# EAGLE board main_xml (EAGLE 7.7.0)
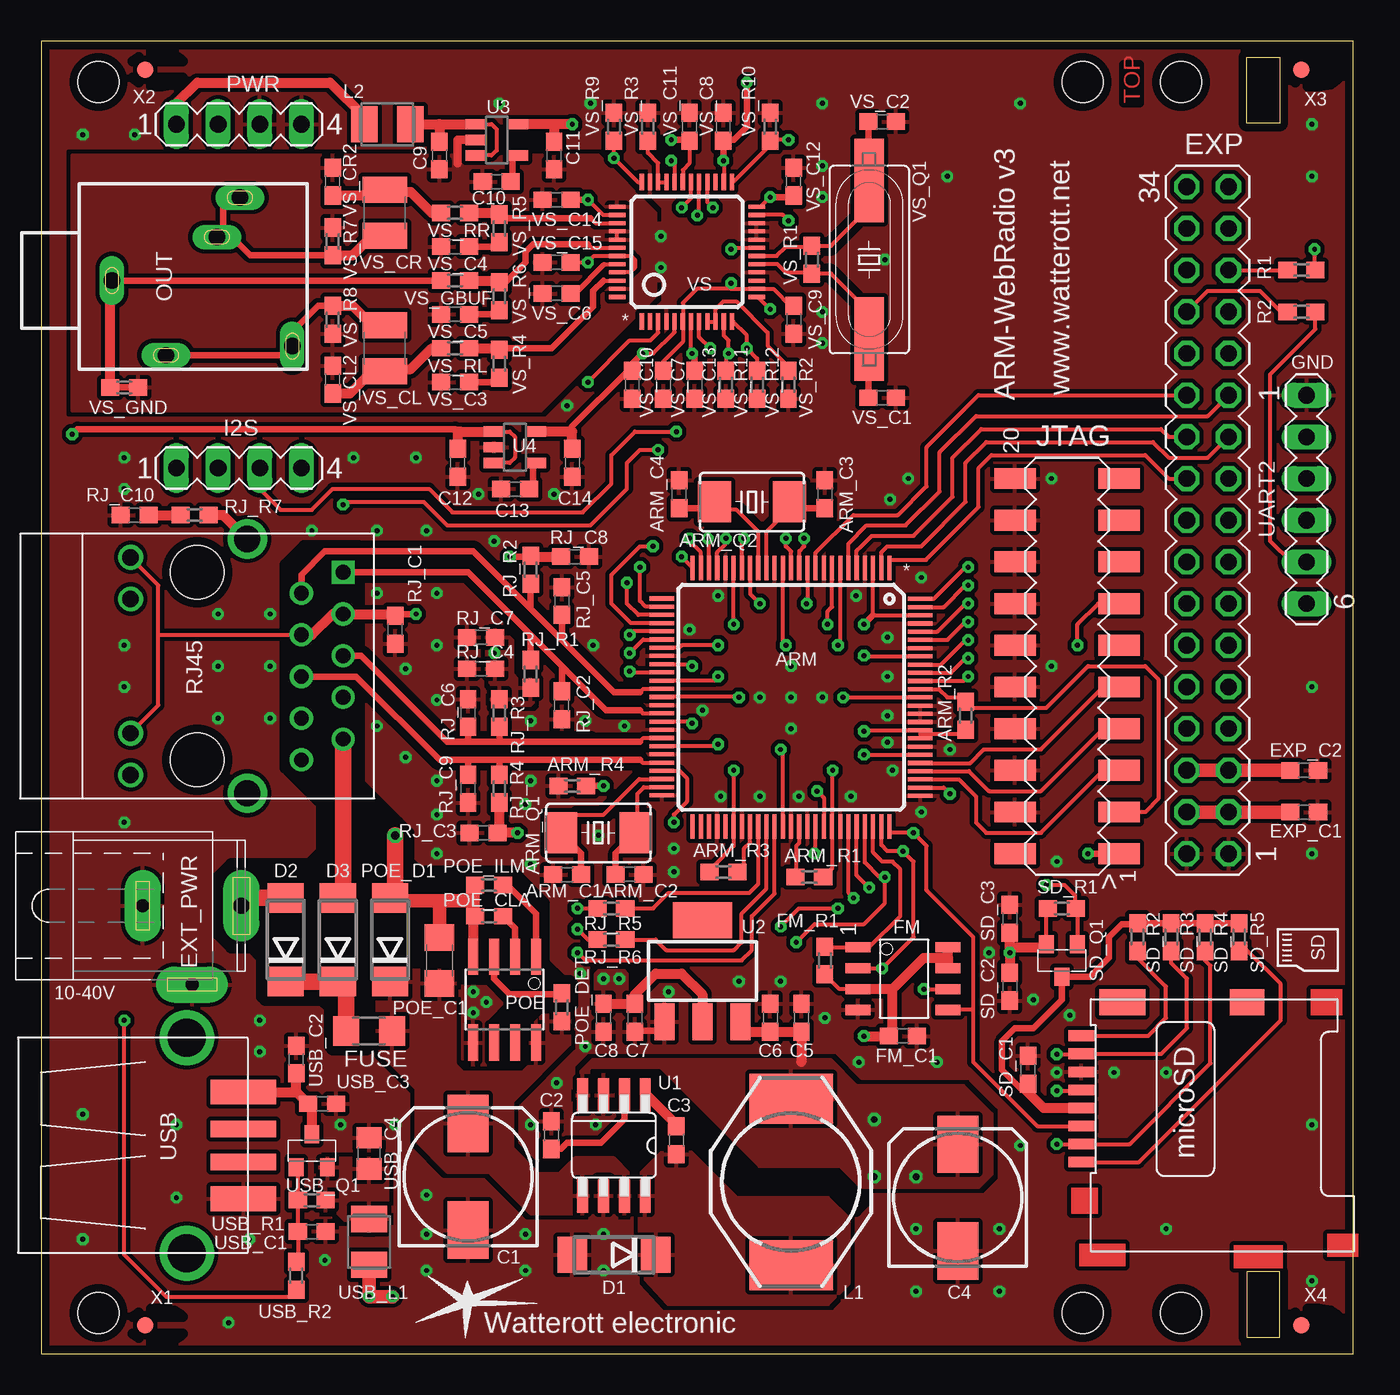
[diagram p4: board, top side]
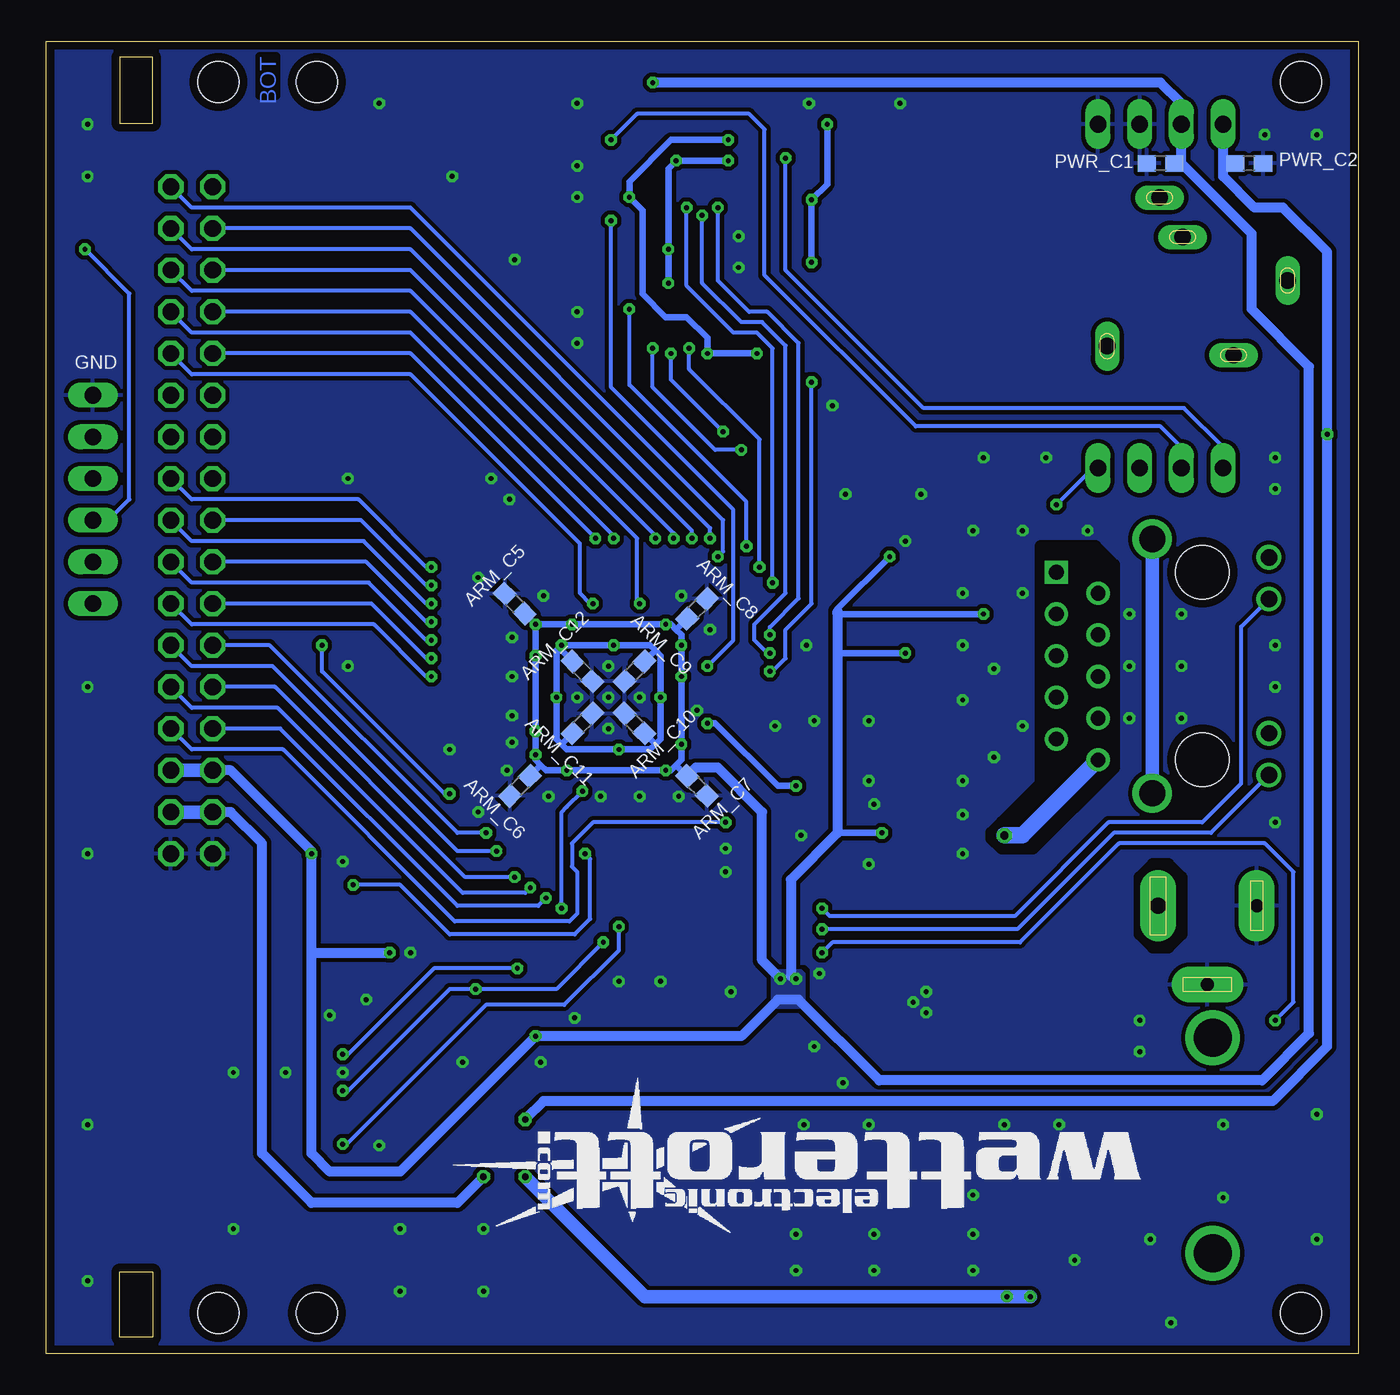
[diagram p5: board, bottom side, seen from below]

Size 80 x 80 mm. Coordinates in mm from the lower left corner, seen from the top.
Outline: 0,0 80,0 80,80 0,80 0,0
Outline: 75.5,1 75.5,5 73.5,5 73.5,1 75.5,1
Outline: 75.5,79 75.5,75 73.5,75 73.5,79 75.5,79
Copper layers (1*16): Top 0.035mm / dielectric 1.5mm / Bottom 0.035mm
Design rules "default *": minimum track width 7mil, minimum drill 0.3mm, track to track 7mil, track to pad 7mil, pad to pad 7mil, via to via 7mil, smd to smd 7mil, copper to edge 20mil, drill to drill 8mil, minimum pad ring 10mil, minimum via ring 8mil, stop-mask expansion 4mil, vias tented up to drill 0.5mm, thermal gap 10mil
Holes 2.5 mm at 3.5,77.5 69.5,77.5 3.5,2.5 69.5,2.5 63.5,2.5 63.5,77.5
tRestrict: area 10.8,18.6 to 32.4,49.2; area 49.7,8.7 to 50.3,9.4; 31 lines
bRestrict: area 14.9,30.8 to 22.4,49.2; area 10.8,24.8 to 13.3,29.8

## Footprints (pad centres in the part's own frame; a part is rotated, then mirrored left to right if it is on the bottom)
LQFP100 = smd 1.5 x 0.25: 1 -7.875,6; 2 -7.875,5.5; 3 -7.875,5; 4 -7.875,4.5; 5 -7.875,4; 6 -7.875,3.5; 7 -7.875,3; 8 -7.875,2.5; 9 -7.875,2; 10 -7.875,1.5; 11 -7.875,1; 12 -7.875,0.5; 13 -7.875,0; 14 -7.875,-0.5; 15 -7.875,-1; 16 -7.875,-1.5; 17 -7.875,-2; 18 -7.875,-2.5; 19 -7.875,-3; 20 -7.875,-3.5; 21 -7.875,-4; 22 -7.875,-4.5; 23 -7.875,-5; 24 -7.875,-5.5; 25 -7.875,-6; 51 7.875,-6; 52 7.875,-5.5; 53 7.875,-5; 54 7.875,-4.5; 55 7.875,-4; 56 7.875,-3.5; 57 7.875,-3; 58 7.875,-2.5; 59 7.875,-2; 60 7.875,-1.5; 61 7.875,-1; 62 7.875,-0.5; 63 7.875,0; 64 7.875,0.5; 65 7.875,1; 66 7.875,1.5; 67 7.875,2; 68 7.875,2.5; 69 7.875,3; 70 7.875,3.5; 71 7.875,4; 72 7.875,4.5; 73 7.875,5; 74 7.875,5.5; 75 7.875,6 | smd 0.25 x 1.5: 26 -6.025,-7.875; 27 -5.525,-7.875; 28 -5.025,-7.875; 29 -4.525,-7.875; 30 -4.025,-7.875; 31 -3.525,-7.875; 32 -3.025,-7.875; 33 -2.525,-7.875; 34 -2.025,-7.875; 35 -1.525,-7.875; 36 -1.025,-7.875; 37 -0.525,-7.875; 38 -0.025,-7.875; 39 0.475,-7.875; 40 0.975,-7.875; 41 1.475,-7.875; 42 1.975,-7.875; 43 2.475,-7.875; 44 2.975,-7.875; 45 3.475,-7.875; 46 3.975,-7.875; 47 4.475,-7.875; 48 4.975,-7.875; 49 5.475,-7.875; 50 5.975,-7.875; 76 6,7.875; 77 5.5,7.875; 78 5,7.875; 79 4.5,7.875; 80 4,7.875; 81 3.5,7.875; 82 3,7.875; 83 2.5,7.875; 84 2,7.875; 85 1.5,7.875; 86 1,7.875; 87 0.5,7.875; 88 0,7.875; 89 -0.5,7.875; 90 -1,7.875; 91 -1.5,7.875; 92 -2,7.875; 93 -2.5,7.875; 94 -3,7.875; 95 -3.5,7.875; 96 -4,7.875; 97 -4.5,7.875; 98 -5,7.875; 99 -5.5,7.875; 100 -6,7.875
C0603 = smd 1.1 x 1: 1 -0.85,0; 2 0.85,0
CS10 = smd 2 x 2.5: 1 -2.286,0; 2 2.286,0
R0603 = smd 1.1 x 1: 1 -0.85,0; 2 0.85,0
153CLV-0810 = smd 3.5 x 2.5: + 3.25,0; - -3.25,0
DO214AA = smd 1.8 x 2.2: A 2.55,0; C -2.55,0
MA17-2 = drill 1.016 octagon: 1 -20.32,-1.27; 2 -20.32,1.27; 3 -17.78,-1.27; 4 -17.78,1.27; 5 -15.24,-1.27; 6 -15.24,1.27; 7 -12.7,-1.27; 8 -12.7,1.27; 9 -10.16,-1.27; 10 -10.16,1.27; 11 -7.62,-1.27; 12 -7.62,1.27; 13 -5.08,-1.27; 14 -5.08,1.27; 15 -2.54,-1.27; 16 -2.54,1.27; 17 0,-1.27; 18 0,1.27; 19 2.54,-1.27; 20 2.54,1.27; 21 5.08,-1.27; 22 5.08,1.27; 23 7.62,-1.27; 24 7.62,1.27; 25 10.16,-1.27; 26 10.16,1.27; 27 12.7,-1.27; 28 12.7,1.27; 29 15.24,-1.27; 30 15.24,1.27; 31 17.78,-1.27; 32 17.78,1.27; 33 20.32,-1.27; 34 20.32,1.27
SPC4077 = drill 0.8 pad 2.184 long: 1 -3,0; 2 0,-4.8 | drill 1 pad 2.184 long: 3 3,0
SO8 = smd 0.61 x 1.524: 1 -1.27,-2.743; 2 0,-2.743; 3 1.27,-2.743; 4 2.54,-2.743; 5 2.54,2.743; 6 1.27,2.743; 7 0,2.743; 8 -1.27,2.743
R1206 = smd 1.6 x 1.8: 1 -1.4,0; 2 1.4,0
MA04-1 = drill 1.016 long: 1 -3.81,0; 2 -1.27,0; 3 1.27,0; 4 3.81,0
MA10-2_SMD = smd 1.27 x 2.54: 1 -11.43,-3.175; 2 -11.43,3.175; 3 -8.89,-3.175; 4 -8.89,3.175; 5 -6.35,-3.175; 6 -6.35,3.175; 7 -3.81,-3.175; 8 -3.81,3.175; 9 -1.27,-3.175; 10 -1.27,3.175; 11 1.27,-3.175; 12 1.27,3.175; 13 3.81,-3.175; 14 3.81,3.175; 15 6.35,-3.175; 16 6.35,3.175; 17 8.89,-3.175; 18 8.89,3.175; 19 11.43,-3.175; 20 11.43,3.175
CDRH = smd 3.048 x 5.08: 1 -5.08,0; 2 5.08,0
L3230M = smd 1.6 x 2.2: 1 -1.4,0; 2 1.4,0
1503_09 = drill 1 pad 1.2 long: 1 0,-2.1; 2 -4.55,-5.4; 3 5.05,-9.9; 4 -4,-13.1; 5 2.65,-8.5
SO08 = smd 0.61 x 2.21: 1 -1.905,-2.616; 2 -0.635,-2.616; 3 0.635,-2.616; 4 1.905,-2.616; 5 1.905,2.616; 6 0.635,2.616; 7 -0.635,2.616; 8 -1.905,2.616
C1206 = smd 1.6 x 1.8: 1 -1.4,0; 2 1.4,0
WE_POE = drill 0.9 square: 1 -5.715,8.89 | drill 0.9: 2 -4.445,6.35; 3 -3.175,8.89; 4 -1.905,6.35; 5 -0.635,8.89; 6 0.635,6.35; 7 1.905,8.89; 8 3.175,6.35; 9 4.445,8.89; 10 5.715,6.35 | drill 1: LED1+ -6.629,-4.064; LED1- -4.089,-4.064; LED2+ 4.089,-4.064; LED2- 6.629,-4.064 | drill 1.6: NC0 -7.747,3.048; NC1 7.747,3.048 | hole 3.25: -5.715,0; 5.715,0
MICRO-SD = smd 0.65 x 1.6: 1 -10.54,16.6; 2 -9.44,16.6; 3 -8.34,16.6; 4 -7.24,16.6; 5 -6.14,16.6; 6 -5.04,16.6; 7 -3.94,16.6; 8 -2.84,16.6 | smd 1.6 x 2.1: K1 -0.8,6.5 | smd 1.6 x 2.8: K2 -0.8,14.1
MICRO3 = smd 0.9 x 1.1: 1 -0.95,-1; 2 0.95,-1; 3 0,1
SO8' = smd 0.66 x 2.032: 1 -1.905,-3.073; 2 -0.635,-3.073; 3 0.635,-3.073; 4 1.905,-3.073; 5 1.905,3.073; 6 0.635,3.073; 7 -0.635,3.073; 8 -1.905,3.073
SOT223 = smd 1.219 x 2.235: 1 -2.311,-3.099; 2 0,-3.099; 3 2.311,-3.099 | smd 3.6 x 2.2: 4 0,3.099
SOT23-5 = smd 0.635 x 1.27: 1 -0.953,-1.27; 2 0,-1.27; 3 0.953,-1.27; 4 0.953,1.27; 5 -0.953,1.27
MA06-1 = drill 1.016 long: 1 -6.35,0; 2 -3.81,0; 3 -1.27,0; 4 1.27,0; 5 3.81,0; 6 6.35,0
USB-A-S = smd 4 x 1: D+ 3.45,-1; D- 3.45,1 | smd 4 x 1.5: GND 3.45,-3.25; VBUS 3.45,3.25 | drill 2.311: P$5 0,-6.566; P$6 0,6.566
C0805 = smd 1.3 x 1.5: 1 -0.95,0; 2 0.95,0
LQFP-48 = smd 0.25 x 1: 1 -2.75,-4.25; 2 -2.25,-4.25; 3 -1.75,-4.25; 4 -1.25,-4.25; 5 -0.75,-4.25; 6 -0.25,-4.25; 7 0.25,-4.25; 8 0.75,-4.25; 9 1.25,-4.25; 10 1.75,-4.25; 11 2.25,-4.25; 12 2.75,-4.25; 25 2.75,4.25; 26 2.25,4.25; 27 1.75,4.25; 28 1.25,4.25; 29 0.75,4.25; 30 0.25,4.25; 31 -0.25,4.25; 32 -0.75,4.25; 33 -1.25,4.25; 34 -1.75,4.25; 35 -2.25,4.25; 36 -2.75,4.25 | smd 1 x 0.25: 13 4.25,-2.75; 14 4.25,-2.25; 15 4.25,-1.75; 16 4.25,-1.25; 17 4.25,-0.75; 18 4.25,-0.25; 19 4.25,0.25; 20 4.25,0.75; 21 4.25,1.25; 22 4.25,1.75; 23 4.25,2.25; 24 4.25,2.75; 37 -4.25,2.75; 38 -4.25,2.25; 39 -4.25,1.75; 40 -4.25,1.25; 41 -4.25,0.75; 42 -4.25,0.25; 43 -4.25,-0.25; 44 -4.25,-0.75; 45 -4.25,-1.25; 46 -4.25,-1.75; 47 -4.25,-2.25; 48 -4.25,-2.75
C1210 = smd 1.6 x 2.7: 1 -1.4,0; 2 1.4,0
SM49 = smd 5.08 x 1.778: 1 -4.826,0; 2 4.826,0
SMD-ELLIPSE = smd 1 x 1: 1 0,0

## Placement (x,y rotation side)
ARM  LM3S6950  [LQFP100]  45.72,40.01 270 top
ARM_C1  18pF  [C0603]  32.07,29.21 180 top
ARM_C2  18pF  [C0603]  35.88,29.21 0 top
ARM_C3  18pF  [C0603]  47.78,52.39 90 top
ARM_C4  18pF  [C0603]  38.89,52.39 90 top
ARM_C5  100nF  [C0603]  51.44,45.72 135 bottom
ARM_C6  100nF  [C0603]  51.12,34.61 225 bottom
ARM_C7  100nF  [C0603]  40.32,34.61 315 bottom
ARM_C8  100nF  [C0603]  40.32,45.4 45 bottom
ARM_C9  100nF  [C0603]  44.13,41.59 225 bottom
ARM_C10  100nF  [C0603]  44.13,38.42 135 bottom
ARM_C11  100nF  [C0603]  47.31,38.42 45 bottom
ARM_C12  100nF  [C0603]  47.31,41.59 315 bottom
ARM_Q1  8MHz  [CS10]  33.97,31.75 180 top
ARM_Q2  25MHz  [CS10]  43.34,51.91 0 top
ARM_R1  10k  [R0603]  46.83,29.05 180 top
ARM_R2  10k  [R0603]  56.36,38.89 270 top
ARM_R3  10k  [R0603]  41.59,29.37 180 top
ARM_R4  12.4k  [R0603]  32.38,34.61 180 top
C1  22uF  [153CLV-0810]  26.04,10.79 90 top
C2  100nF  [C0603]  31.11,13.34 90 top
C3  100nF  [C0603]  38.73,13.02 270 top
C4  100uF  [153CLV-0810]  55.88,9.53 90 top
C5  2uF  [C0603]  46.36,20.48 90 top
C6  100nF  [C0603]  44.45,20.48 270 top
C7  100nF  [C0603]  36.2,20.48 270 top
C8  2uF  [C0603]  34.29,20.48 270 top
C9  2uF  [C0603]  24.29,73.03 90 top
C10  10nF  [C0603]  27.78,71.44 180 top
C11  2uF  [C0603]  31.27,73.03 270 top
C12  2uF  [C0603]  25.4,54.29 90 top
C13  10nF  [C0603]  28.89,52.7 180 top
C14  2uF  [C0603]  32.38,54.29 270 top
D1  [DO214AA]  34.92,6.03 180 top
D2  [DO214AA]  14.92,25.24 90 top
D3  [DO214AA]  18.1,25.24 90 top
EXP  [MA17-2]  71.12,50.8 90 top
EXP_C1  100nF  [C0603]  76.99,33.02 180 top
EXP_C2  100nF  [C0603]  76.99,35.56 180 top
EXT_PWR  [SPC4077]  9.21,27.3 0 top
FM  FM25V...  [SO8]  52.55,23.5 270 top
FM_C1  100nF  [C0603]  52.55,19.37 0 top
FM_R1  47k  [R0603]  47.78,23.97 270 top
FUSE  1A  [R1206]  20,19.68 0 top
I2S  [MA04-1]  12.06,53.98 0 top
JTAG  [MA10-2_SMD]  62.55,41.91 90 top
L1  100uH  [CDRH]  45.72,10.48 90 top
L2  10uH  [L3230M]  21.11,74.93 0 top
OUT  1503_09  [1503_09]  2.22,65.41 90 top
POE  TPS2375D  [SO08]  28.26,21.59 180 top
POE_C1  100nF  [C1206]  24.29,23.97 90 top
POE_CLA  4,3k  [R0603]  27.3,26.67 0 top
POE_D1  SMAJ58A  [DO214AA]  21.27,25.24 90 top
POE_DET  24k  [R0603]  31.75,21.11 90 top
POE_ILM  100k  [R0603]  27.3,28.57 0 top
PWR  [MA04-1]  12.06,74.93 0 top
PWR_C1  100nF  [C0603]  12.06,72.55 0 bottom
PWR_C2  100nF  [C0603]  6.67,72.55 180 bottom
R1  470*  [R0603]  76.84,66.04 0 top
R2  470*  [R0603]  76.83,63.5 0 top
RJ  RJ45-8-POEWE  [WE_POE]  9.53,41.91 270 top
RJ_C1  100nF  [C0603]  21.59,44.13 270 top
RJ_C2  10pF  [C0603]  31.75,39.53 90 top
RJ_C3  10nF  [C0603]  26.99,31.75 0 top
RJ_C4  10nF  [C0603]  26.83,41.75 0 top
RJ_C5  10pF  [C0603]  31.75,45.88 270 top
RJ_C6  10pF  [C0603]  26.03,39.05 270 top
RJ_C7  10nF  [C0603]  26.83,43.66 0 top
RJ_C8  10nF  [C0603]  32.54,48.58 180 top
RJ_C9  10pF  [C0603]  26.04,34.45 90 top
RJ_C10  10nF  [C0603]  5.71,51.12 180 top
RJ_R1  50  [R0603]  29.84,41.43 270 top
RJ_R2  50  [R0603]  29.85,47.78 90 top
RJ_R3  50  [R0603]  27.94,39.05 90 top
RJ_R4  50  [R0603]  27.94,34.45 270 top
RJ_R5  470  [R0603]  34.77,27.15 0 top
RJ_R6  470  [R0603]  34.77,25.24 0 top
RJ_R7  100  [R0603]  9.37,51.12 0 top
SD  MICRO-SD  [MICRO-SD]  80.01,22.23 90 top
SD_C1  100nF  [C0603]  60.17,17.3 90 top
SD_C2  100nF  [C0603]  59.05,22.38 90 top
SD_C3  2uF  [C0603]  59.05,26.51 270 top
SD_Q1  P-CHN  [MICRO3]  62.23,23.97 180 top
SD_R1  47k  [R0603]  62.23,27.15 0 top
SD_R2  47k  [R0603]  66.83,25.4 270 top
SD_R3  47k  [R0603]  68.9,25.4 270 top
SD_R4  47k  [R0603]  70.96,25.4 270 top
SD_R5  47k  [R0603]  73.03,25.4 270 top
U1  MAX5035BUSA  [SO8']  34.92,12.7 180 top
U2  TS1117-3V3  [SOT223]  40.32,23.34 0 top
U3  LP2985-2V8  [SOT23-5]  27.78,73.98 270 top
U4  LP2985-1V8  [SOT23-5]  28.89,55.24 270 top
UART2  [MA06-1]  77.15,52.07 270 top
USB  USB-A-S  [USB-A-S]  8.89,12.7 0 top
USB_C1  1uF  [C0603]  16.51,7.46 180 top
USB_C2  10nF  [C0603]  15.56,17.94 90 top
USB_C3  100nF  [C0603]  17.15,15.24 0 top
USB_C4  2uF  [C0805]  20,12.22 270 top
USB_L1  10uH  [L3230M]  20,6.83 90 top
USB_Q1  P-CHN  [MICRO3]  16.51,12.38 0 top
USB_R1  47k  [R0603]  16.51,9.37 180 top
USB_R2  24k  [R0603]  15.56,4.76 270 top
VS  VS1053  [LQFP-48]  39.37,67.15 0 top
VS_C1  27pF  [C0603]  51.28,58.26 0 top
VS_C2  27pF  [C0603]  51.28,75.09 0 top
VS_C3  10nF  [C0603]  25.24,59.21 0 top
VS_C4  10nF  [C0603]  25.24,67.47 0 top
VS_C5  47nF  [C0603]  25.24,63.34 0 top
VS_C6  1uF  [C0603]  31.43,64.61 0 top
VS_C7  100nF  [C0603]  37.94,59.06 270 top
VS_C8  100nF  [C0603]  41.59,74.77 90 top
VS_C9  100nF  [C0603]  45.88,63.02 270 top
VS_C10  100nF  [C0603]  36.04,59.05 270 top
VS_C11  100nF  [C0603]  39.53,74.77 90 top
VS_C12  100nF  [C0603]  45.88,71.44 90 top
VS_C13  100nF  [C0603]  39.85,59.06 270 top
VS_C14  100nF  [C0603]  31.43,70.33 180 top
VS_C15  100nF  [C0603]  31.43,66.52 180 top
VS_CL  10uF  [C1210]  20.95,61.28 90 top
VS_CL2  2.2nF  [C0603]  17.78,59.37 90 top
VS_CR  10uF  [C1210]  20.96,69.53 270 top
VS_CR2  2.2nF  [C0603]  17.78,71.44 90 top
VS_GBUF  0*  [R0603]  25.24,65.4 180 top
VS_GND  0*  [R0603]  5.08,58.9 0 top
VS_Q1  12.288MHz  [SM49]  50.48,66.67 270 top
VS_R1  1M  [R0603]  46.99,66.67 90 top
VS_R2  100k  [R0603]  45.56,59.05 90 top
VS_R3  100k  [R0603]  36.99,74.77 270 top
VS_R4  22  [R0603]  27.94,60.33 90 top
VS_R5  22  [R0603]  27.94,68.58 90 top
VS_R6  10  [R0603]  27.94,64.45 90 top
VS_R7  10k  [R0603]  17.78,67.79 90 top
VS_R8  10k  [R0603]  17.78,63.02 270 top
VS_R9  100k  [R0603]  34.93,74.77 90 top
VS_R10  100k  [R0603]  44.45,74.77 90 top
VS_R11  100k  [R0603]  41.75,59.06 270 top
VS_R12  100k  [R0603]  43.66,59.05 270 top
VS_RL  470  [R0603]  25.24,61.28 180 top
VS_RR  470  [R0603]  25.24,69.53 180 top
X1  [SMD-ELLIPSE]  6.35,1.75 90 top
X2  [SMD-ELLIPSE]  6.35,78.26 90 top
X3  [SMD-ELLIPSE]  76.84,78.26 90 top
X4  [SMD-ELLIPSE]  76.83,1.75 90 top

## Tracks (layer width: path | path; a pad name or v marks a point on that pad's centre or on a via)
5V_VIN
  Top 0.254: U3.3 27.46,73.03 27.78,73.34 27.78,74.61 27.46,74.93 U3.1
  Top 0.61: L2.2 24.29,74.93 | 24.29,74.93 C9.2 | 24.29,74.93 U3.1
7  (via drill 0.3)
  Top 0.254: ARM.47 38.92,35.53 39.37,35.08 39.37,33.66 38.58,32.86 v38.58,32.38
  Bottom 0.254: v38.58,32.38 46.67,32.38 47.94,31.11 47.94,29.69 47.62,29.37 47.62,26.83 48.1,26.35 55.09,26.35 65.56,36.83 71.12,36.83 EXP.7
8  (via drill 0.3)
  Top 0.254: ARM.70 49.22,28.09 v49.53,27.78
  Bottom 0.254: v49.53,27.78 50.01,27.3 54.93,27.3 65.72,38.1 EXP.8
9  (via drill 0.3)
  Top 0.254: ARM.71 49.72,29.18 v50.48,28.42
  Bottom 0.254: v50.48,28.42 50.8,28.1 54.61,28.1 65.88,39.37 71.12,39.37 EXP.9
13  (via drill 0.3)
  Top 0.254: ARM.90 56.24,41.01 v56.52,41.27
  Bottom 0.254: v56.52,41.27 | v56.52,41.27 56.83,41.27 60.01,44.45 71.12,44.45 EXP.13
14  (via drill 0.3)
  Top 0.254: ARM.91 55.48,41.51 56.36,42.39 v56.52,42.39
  Bottom 0.254: v56.52,42.39 56.83,42.39 60.17,45.72 EXP.14
15  (via drill 0.3)
  Top 0.254: ARM.92 54.86,42.01 56.36,43.5 v56.52,43.5
  Bottom 0.254: v56.52,43.5 56.83,43.5 60.33,46.99 71.12,46.99 EXP.15
16  (via drill 0.3)
  Top 0.254: ARM.95 55.25,43.51 56.36,44.61 v56.52,44.61
  Bottom 0.254: v56.52,44.61 56.83,44.61 60.48,48.26 EXP.16
17  (via drill 0.3)
  Top 0.254: ARM.96 54.64,44.01 56.36,45.72 v56.52,45.72
  Bottom 0.254: v56.52,45.72 56.83,45.72 60.64,49.53 71.12,49.53 EXP.17
18  (via drill 0.3)
  Top 0.254: ARM.99 55.03,45.51 56.36,46.83 v56.52,46.83 | v56.52,46.83
  Bottom 0.254: v56.52,46.83 56.83,46.83 60.8,50.8 EXP.18
19  (via drill 0.3)
  Top 0.254: ARM.100 54.42,46.01 56.36,47.94 v56.52,47.94 | v56.52,47.94
  Bottom 0.254: v56.52,47.94 56.83,47.94 60.96,52.07 71.12,52.07 EXP.19
20
  Top 0.254: 51.75,48.39 51.72,48.39 | 51.75,48.39 53.94,48.39 57.15,51.59 57.15,53.98 57.94,54.77 67.31,54.77 68.74,53.34 EXP.20 | ARM.1 51.72,48.35 51.75,48.39
21
  Top 0.254: ARM.2 51.22,48.84 51.59,49.21 53.66,49.21 56.36,51.91 56.36,54.29 57.63,55.56 67.79,55.56 68.74,54.61 71.12,54.61 EXP.21
22
  Top 0.254: ARM.5 49.72,48.93 50.01,49.21 50.64,49.85 53.18,49.85 55.56,52.23 55.56,54.61 57.31,56.36 68.26,56.36 68.74,55.88 EXP.22
23
  Top 0.254: ARM.6 49.22,49.38 50.32,50.48 52.7,50.48 54.77,52.55 54.77,54.93 56.99,57.15 71.12,57.15 EXP.23
24
  Top 0.254: ARM.10 47.22,48.81 49.53,51.12 52.23,51.12 53.98,52.86 53.98,55.24 57.15,58.42 EXP.24
25  (via drill 0.3)
  Top 0.254: ARM.11 46.72,45.77 v46.67,45.72
  Bottom 0.254: v46.67,45.72 46.83,45.72 47.47,46.35 47.47,49.37 57.78,59.69 71.12,59.69 EXP.25
26  (via drill 0.3)
  Top 0.254: v46.51,49.69 46.51,49.21 46.22,48.92 ARM.12
  Bottom 0.254: v46.51,49.69 | v46.51,49.69 57.78,60.96 EXP.26
27  (via drill 0.3)
  Top 0.254: v45.4,49.69 45.4,49.21 45.72,48.9 ARM.13
  Bottom 0.254: EXP.27 71.12,62.23 57.78,62.23 45.4,49.85 v45.4,49.69 | v45.4,49.69
28  (via drill 0.3)
  Top 0.254: v43.81,45.72 43.22,46.31 ARM.18 | R2.1 75.56,63.5 74.3,64.77 71.12,64.77 EXP.28
  Bottom 0.254: v43.81,45.72 43.97,45.88 43.97,49.69 57.78,63.5 EXP.28
29  (via drill 0.3)
  Top 0.254: v42.86,49.69 42.72,49.55 | v42.86,49.69 | ARM.19 42.72,49.55 | 42.72,49.55 v42.86,49.69 | EXP.29 R1.1 | R1.1
  Bottom 0.254: v42.86,49.69 42.86,49.85 57.78,64.77 71.12,64.77 EXP.29
30  (via drill 0.3)
  Top 0.254: v41.75,49.69 41.75,49.37 41.22,48.84 ARM.22
  Bottom 0.254: v41.75,49.69 41.75,50.01 57.78,66.04 EXP.30
31  (via drill 0.3)
  Top 0.254: v40.64,49.69 | v40.64,49.69 40.72,49.61 | ARM.23 40.72,49.61 | 40.72,49.61 v40.64,49.69
  Bottom 0.254: v40.64,49.69 40.64,50.16 57.78,67.31 71.12,67.31 EXP.31
32  (via drill 0.3)
  Top 0.254: v39.53,49.69 39.53,49.53 40.22,48.84 ARM.24
  Bottom 0.254: v39.53,49.69 39.53,50.32 57.78,68.58 EXP.32
33  (via drill 0.3)
  Top 0.254: ARM.25 39.72,47.91 v39.05,48.58
  Bottom 0.254: 38.73,48.9 38.73,50.8 57.78,69.85 71.12,69.85 EXP.33 | 38.73,48.9 | v39.05,48.58 38.73,48.9
+1V8  (via drill 0.3)
  Top 0.254: 45.72,70.48 | VS.7 39.62,61.03 v39.69,60.96 | VS.31 39.12,72.14 39.53,72.55 VS_C11.1 39.59,73.98 39.63,73.98 | VS.24 43.87,69.9 v44.45,70.48 | VS.5 38.62,62.27 38.58,62.23 37.31,60.96 v36.67,60.96 | 32.38,56.2 32.38,56.36 | 45.72,70.48 45.78,70.48 VS_C12.1 | 36.14,59.85 36.09,59.85 VS_C10.1 | VS_C13.1
  Top 0.406: v38.42,73.98 39.63,73.98 | v44.45,70.48 45.72,70.48 45.82,70.48 | 32.38,56.36 32.38,56.52 35.72,59.85 36.14,59.85 | VS_C10.1 36.04,60.33 v36.67,60.96 | VS_C13.1 39.85,60.8 v39.69,60.96
  Top 0.61: U4.5 32.38,56.2 C14.1
  Bottom 0.254: v39.69,60.96
  Bottom 0.406: v38.42,73.98 41.91,73.98 44.45,71.44 v44.45,70.48 43.66,69.69 43.66,64.61 42.23,63.18 40.96,63.18 39.69,61.91 v39.69,60.96 | v36.67,60.96 v39.69,60.96
+2V5  (via drill 0.3)
  Top 0.254: 42.55,40.03 v42.55,40.01 42.52,40.03 ARM.38 | ARM.62 45.22,36.7 v45.09,36.83 | v48.9,40.01 ARM.88 | ARM.7 48.72,43.32 v48.58,43.18 | ARM.14 45.22,43.36 v45.4,43.18
  Bottom 0.254: v48.58,43.18 48.74,43.02 | v48.58,43.18
  Bottom 0.406: 42.86,37.15 42.55,37.47 v42.55,40.01 42.55,42.55 42.86,42.86 | 42.86,37.15 43.18,36.83 v45.09,36.83 48.26,36.83 48.58,37.15 | 42.86,42.86 43.18,43.18 v45.4,43.18 v48.58,43.18 48.9,42.86 v48.9,40.01 48.9,37.47 48.58,37.15 | 42.86,42.86 ARM_C9.1 | 42.86,37.15 ARM_C10.1 | 48.58,37.15 ARM_C11.1 | 48.74,43.02 ARM_C12.1
+2V8  (via drill 0.3)
  Top 0.254: VS.38 34.26,69.4 v33.34,70.33 | VS_C15.1 v33.34,66.52 33.72,66.9 VS.43 35.97,66.9 36.2,66.67 36.2,66.2 35.9,65.9 VS.45
  Top 0.406: 32.23,70.33 VS_C14.1 v33.34,70.33 | 31.11,74.93 | v32.38,74.93
  Top 0.61: 31.27,74.93 31.11,74.93 U3.5 | 31.27,74.93 C11.1 | v32.38,74.93 31.27,74.93
  Bottom 0.406: v33.34,66.52 v33.34,70.33 32.38,71.28 v32.38,74.93
+3V3  (via drill 0.3)
  Top 0.254: v47.94,44.45 47.94,45.24 48.22,45.52 ARM.8 | FM.8 55.24,24.77 55.29,24.72 | v41.27,43.18 39.05,43.18 38.9,43.03 ARM.32 | 51.85,19.53 51.91,19.53 | 42.07,64.9 39.98,64.9 39.12,64.04 VS.6 39.12,61.66 37.94,60.48 VS_C7.1 | 42.07,64.9 VS.14 44.64,64.9 45.72,63.82 45.82,63.82 VS_C9.1 | v42.07,65.25 42.07,64.9 | VS.32 38.62,72.5 v38.42,72.71 | 41.43,72.71 v41.59,72.71 41.62,72.68 VS.26 | ARM.44 41.16,37.03 v41.27,37.15 | ARM.36 41.03,41.03 v41.27,41.27 | v48.26,35.56 48.22,35.52 ARM.68 48.22,29.59 ARM_R1.1 | v42.23,35.56 v42.22,35.55 ARM.56 42.22,30.95 40.96,29.69 40.96,29.58 ARM_R3.2 | ARM.98 50.72,45.01 ARM.3 | ARM.93 50.2,42.51 v50.16,42.55 | SD_R1.1 61.28,27.05 SD_Q1.2 61.28,24.77 | RJ.LED1+ 5.46,48.51 7.14,46.83 7.14,43.81 | RJ.LED2+ 5.46,37.85 7.14,39.53 7.14,43.81 | 7.14,43.81 RJ.4 | VS_C7.1 | VS_C9.1 | VS.19 42.16,67.4 v42.07,67.31 | ARM.20 v42.22,44.46 v42.23,44.45 | RJ_C3.2 27.94,31.85 | 50.01,22.23 48.68,22.23 FM_R1.2 | ARM.81 50.17,36.51 v50.16,36.51 | v50.16,37.94 50.23,38.01 ARM.84 53.59,37.78 | 53.59,37.78 ARM.83 | 56.09,37.78 53.59,37.78
  Top 0.406: 50.01,22.23 FM.3 | FM_C1.1 51.85,19.53 | v41.59,72.71 VS_C8.1 41.65,73.98 42.23,73.98 43.02,74.77 v43.02,77.47 | v50.16,44.45 50.72,45.01 | v63.82,30.48 JTAG.1 | v22.86,45.09 21.69,45.09 RJ_C1.1 | 56.09,37.78 ARM_R2.2 | 29.9,48.58 RJ_R2.2 29.79,48.58 v28.57,48.58
  Top 0.61: RJ.4 16.51,43.81 17.78,45.09 RJ.3 21.49,45.09 RJ_C1.1 | 55.29,24.13 FM.7 | 55.29,24.13 55.29,24.72 | 51.91,19.53 51.91,22.23 | 51.91,22.23 50.01,22.23 | 51.91,22.23 53.82,24.13 55.29,24.13 | v50.16,19.37 FM_C1.1 | SD_C2.2 v59.05,24.45 59.05,24.77 | 59.05,24.77 SD_C3.2 | 59.05,24.77 61.28,24.77 | v29.05,31.75 RJ_C3.2 | 27.94,31.85 RJ_R4.2 | U2.2 40.32,21.91 39.05,23.18 37.47,23.18 36.2,21.91 C7.1 C8.1 | C8.1 | 29.9,48.58 RJ_C8.2
  Top 0.813: EXP.6 EXP_C2.2 | EXP.6
  Bottom 0.254: v42.07,67.31
  Bottom 0.406: v50.16,44.45 v47.94,44.45 v42.23,44.45 41.91,44.45 41.59,44.13 | 49.85,35.88 49.53,35.56 v48.26,35.56 v42.23,35.56 41.91,35.56 41.59,35.88 | 49.85,35.88 50.16,36.2 v50.16,36.51 v50.16,37.94 v50.16,42.55 v50.16,44.45 | 41.59,44.13 41.27,43.81 v41.27,43.18 v41.27,41.27 v41.27,37.15 41.27,36.2 41.59,35.88 | ARM_C7.1 41.59,35.88 | 49.85,35.88 ARM_C6.1 | 41.59,44.13 ARM_C8.1 | v50.16,44.45 ARM_C5.1 | v38.42,72.71 v41.59,72.71 42.07,72.23 v42.07,67.31 v42.07,65.25 | v27.62,42.7 31.75,42.7 | 31.75,31.75 v29.05,31.75 | v28.57,48.58 | v28.57,48.58 31.75,45.4 31.75,45.24 | v28.57,48.58 | v28.57,48.58 | v22.86,45.09 31.75,45.09
  Bottom 0.61: 63.82,24.45 63.82,12.22 62.71,11.11 58.42,11.11 v50.16,19.37 37.62,19.37 35.4,21.59 34.13,21.59 29.21,16.67 5.87,16.67 3.02,19.53 3.02,60.17 | 63.82,24.45 v63.82,30.48 63.82,30.64 | 63.82,24.45 v59.05,24.45 | v43.02,77.47 12.06,77.47 10.79,76.2 PWR.2 10.79,72.55 | ARM_C7.1 40.41,35.72 39.05,35.72 36.35,33.02 36.35,23.97 35.4,23.02 | 63.82,30.64 | 63.82,30.64 68.74,35.56 | 3.02,60.17 6.51,63.66 6.51,68.26 10.79,72.55 | 68.74,35.56 | 68.74,35.56 EXP.6 | 3.02,60.17 | 31.75,45.24 31.75,45.09 31.75,42.7 31.75,31.75 34.61,28.89 34.61,23.02 | 10.79,72.55 PWR_C1.2 | 10.79,72.55
  Bottom 0.813: EXP.6 EXP.5
  other vias: 34.29,22.86 35.24,22.86
  pour Top (isolate 0.254): 27.15,44.13 27.15,41.12 27.46,40.8 27.46,39.53 29.84,39.53 30.16,39.85 30.16,41.12 29.05,41.12 28.73,41.43 28.73,43.5 28.1,44.13
  pour Bottom (isolate 0.254): 33.81,23.18 33.97,23.34 35.56,23.34 35.72,23.18 35.72,21.27 35.56,21.11 33.97,21.11 33.81,21.27
  pour Top (isolate 0.254): 33.81,23.18 33.97,23.34 35.56,23.34 35.72,23.18 35.72,21.27 35.56,21.11 33.97,21.11 33.81,21.27
+5V  (via drill 0.3, 0.4)
  Top 0.254: U4.1 28.57,56.2 28.89,55.88 28.89,54.61 28.57,54.29 U4.3
  Top 0.406: U1.4 33.02,15.56 | 25.4,56.2 25.56,56.2 25.4,56.2 | 25.4,56.2 25.24,56.36 2.22,56.36 v1.91,56.04
  Top 0.61: 25.4,56.2 C12.2 | 25.56,56.2 U4.1 | PWR.1 8.26,76.2 9.53,77.47 17.62,77.47 19.71,75.38 L2.1 | C6.2 42.63,19.63 U2.3 | C6.2 C5.1 46.35,17.78 | C6.2
  Top 0.813: USB_L1.1 v20,3.49 v21.43,3.49 | EXP.4 EXP_C1.2
  Bottom 0.406: PWR.1 8.26,73.18 | 8.26,72.55 PWR_C2.2 | v50.8,14.29
  Bottom 0.61: 1.91,67.15 4.6,69.85 6.35,69.85 8.26,71.75 8.26,72.55 PWR.1 | EXP.4 68.74,33.02 66.83,31.11 66.83,12.22 63.82,9.21 54.93,9.21 v53.34,10.79 | v53.34,10.79 | 1.91,67.15 v1.91,56.04 1.91,18.73 5.24,15.4 49.69,15.4 v50.8,14.29 | 1.91,67.15
  Bottom 0.813: v50.8,10.79 43.5,3.49 v21.43,3.49 v20,3.49 | v50.8,10.79 | EXP.4 EXP.3
  pour Top (isolate 0.406): 43.82,11.43 37.78,17.46 33.5,17.46 33.34,17.3 33.34,15.08 32.7,15.08 32.7,16.99 33.65,17.94 48.1,17.94 49.69,16.35 56.2,16.35 57.94,14.61 57.94,10.95 57.15,10.16 50.01,10.16 48.74,11.43
AGND
  Top 0.254: VS.40 35.12,68.39 VS.41
  Top 0.508: U3.2 25.4,73.98 25.4,72.55
  pour Top (isolate 0.254): 1.91,73.03 33.97,73.03 37.47,69.53 37.47,64.45 30.48,57.47 1.91,57.47
BST
  Top 0.406: 36.83,15.88 U1.1
  Top 0.61: C3.1 38.73,13.97 36.83,15.88
CLASS
  Top 0.406: POE.2 28.89,25.93 POE_CLA.2
DET
  Top 0.254: 31.69,21.91 POE_DET.2
  Top 0.406: POE.3 27.62,22.86 28.57,21.91 31.69,21.91
ERBIAS  (via drill 0.3)
  Top 0.254: ARM.41 39.58,38.53 v39.69,38.42
  Top 0.406: ARM_R4.1 v34.29,34.61
  Bottom 0.406: v39.69,38.42 39.21,38.42 35.4,34.61 v34.29,34.61
FM_CS
  Top 0.254: 49.85,24.77 FM.1 | ARM.73 50.72,30.56 51.28,30 51.91,30 52.39,29.53 52.39,26.67 50.48,24.77 49.85,24.77 | 49.85,24.77 47.84,24.77 FM_R1.1
GBUF
  Top 0.254: 27.84,65.41 VS_R6.2 | VS.42 33.56,67.4 33.34,67.63
  Top 0.406: 33.34,67.63 30,67.63 29.53,67.15 29.53,66.52 28.31,65.3 VS_R6.2
  Top 0.61: VS_GBUF.1 27.84,65.41
GND  (via drill 0.3)
  Top 0.406: 36.2,19.68 37.94,19.68
  other vias: 37.78,66.2 45.72,40.01 40.32,39.21 53.66,47.31 51.59,38.89 55.4,36.83 53.34,3.81 43.81,33.97 51.59,41.27 8.26,9.53 49.37,33.97 51.59,43.66 23.5,9.68 43.81,40.01 45.72,41.91 47.62,40.01 45.72,38.1 39.53,44.13 46.2,33.97 5.08,43.18 41.43,33.97 12.7,6.99 53.34,7.62 13.34,18.41 34.29,7.3 33.81,13.97 34.29,5.08 23.5,7.3 29.53,7.3 23.5,5.08 29.53,5.08 58.42,7.62 58.42,3.81 26.35,22.07 27.15,21.43 21.59,13.97 29.84,13.97 37.78,68.1 51.44,66.68 47.62,70.49 47.62,63.5 31.27,52.39 10.79,45.09 33.5,76.2 61.91,17.14 65.41,17.14 47.62,76.2 5.08,32.38 5.08,54.61 17.3,5.72 57.78,24.45 68.58,17.14 26.67,52.39 77.47,30.48 77.47,40.64 49.85,17.78 10.79,38.73 5.71,74.3 59.69,76.2 32.07,57.79 77.47,13.97 61.91,30 2.54,14.61 61.6,53.34 26.35,20.8 13.34,20.32 61.59,41.91 41.27,46.2 51.91,35.56 49.69,46.2 13.97,38.73 13.97,45.09 10.79,41.91 13.97,41.91 77.47,4.45 77.47,74.93 5.08,52.7 5.08,40.64 55.24,71.75 2.54,6.99 47.62,72.39 47.62,61.6 52.86,53.34 27.94,76.2 2.54,74.3 24.13,39.85 35.56,38.26 33.18,38.58 29.84,38.58 22.23,41.75 22.23,36.35 29.84,34.92 20.48,46.35 33.65,43.18 38.58,29.37 24.13,34.92 29.84,29.84 59.69,12.7 60.48,21.59 54.61,17.78 27.62,49.53 22.86,54.61 31.43,16.51 20.48,50.16 18.26,13.97 20.48,38.26 51.75,52.07 77.47,71.75 38.26,22.07 45.09,22.7 47.78,20.48 53.66,33.02 38.58,30.8 42.55,22.7 24.13,30.48 24.13,43.18 24.13,32.86 29.53,33.5 8.26,13.97 32.86,23.18 33.18,18.73 23.49,50.16 16.51,50.16 68.58,7.62 24.13,46.36 33.97,31.59 62.71,20.64 51.59,37.26 11.43,1.91 19.05,54.61
  pour Top (isolate 0.254, rank 2): 0.5,79.5 79.5,79.5 79.5,0.5 0.5,0.5
  pour Bottom (isolate 0.254, rank 2): 0.5,79.5 79.5,79.5 79.5,0.5 0.5,0.5
  pour Top (isolate 0.254): 37.15,68.9 38.42,68.9 38.42,65.41 37.15,65.41
I2S_LROUT  (via drill 0.3)
  Top 0.254: VS.36 36.39,71.4 v34.92,72.87 VS_R9.1 | VS_R9.1
  Bottom 0.254: 26.51,57.63 34.92,66.04 v34.92,72.87 | I2S.1 8.26,55.24 10.64,57.63 26.51,57.63 | 26.51,57.63
I2S_MCLK  (via drill 0.3)
  Top 0.254: VS.25 42.19,71.4 44.45,73.66 VS_R10.1 44.51,73.98 v45.56,73.98
  Bottom 0.254: 43.97,75.56 v45.56,73.98 | I2S.2 10.79,55.24 12.06,56.52 26.99,56.52 36.2,65.72 36.2,74.61 37.15,75.56 43.97,75.56 | 43.97,75.56
I2S_SCLK  (via drill 0.3)
  Top 0.254: VS.11 41.62,62.04 41.91,61.75 v41.91,60.96 41.75,60.8 VS_R11.1 | v38.73,56.2 36.2,56.2 34.77,54.77 34.77,53.02 33.02,51.28 25.08,51.28 23.65,52.7 17.78,52.7 16.51,51.44 14.61,51.44 13.34,52.7 I2S.3
  Bottom 0.254: v38.73,56.2 | v38.73,56.2 41.91,59.37 v41.91,60.96
I2S_SDATA  (via drill 0.3)
  Top 0.254: VS.12 42.19,62.9 43.02,62.07 v43.02,61.28 | v43.02,61.28 | VS_R12.1 43.66,60.64 v43.02,61.28 | v37.62,55.09 36.51,55.09 35.72,54.29 35.72,52.7 33.5,50.48 24.77,50.48 23.34,51.91 18.57,51.91 v18.41,51.75
  Bottom 0.254: 43.02,58.9 v43.02,61.28 | v43.02,61.28 | v37.62,55.09 39.21,55.09 43.02,58.9 | 43.02,58.9 | I2S.4 16.19,53.98 v18.41,51.75
ILM
  Top 0.254: 28.42,28.57 POE_ILM.2
  Top 0.406: POE.1 30.16,26.83 28.42,28.57
LED1
  Top 0.254: ARM.59 43.72,28.64 43.18,28.1 38.26,28.1 37.31,27.15 RJ_R5.2 | RJ_R5.2
LED2
  Top 0.254: ARM.60 44.22,28.34 42.7,26.83 42.7,25.08 42.23,24.61 38.1,24.61 37.47,25.24 RJ_R6.2
LEFT
  Top 0.254: 34.29,65.4 VS.46 | 27.84,61.28 VS_R4.2 27.94,61.28
  Top 0.406: 34.29,65.4 33.66,64.77 33.66,63.82 31.11,61.28 27.94,61.28
  Top 0.61: VS_RL.1 27.84,61.28
MDIO
  Top 0.254: ARM.58 43.22,31.16 42.86,30.8 42.86,29.79 ARM_R3.1
N$2
  pour Top (isolate 0.254): 16.99,11.91 21.11,11.91 21.11,7.46 19.21,7.46 17.94,8.73 16.99,8.73
N$3
  Top 0.254: VS.33 VS.34 37.62,72.55 36.99,73.18 VS_R3.2
N$4  (via drill 0.3)
  Top 0.254: RJ_R6.1 33.34,25.24 v32.7,25.88
  Bottom 0.254: RJ.LED2- 8.99,31.75 14.92,31.75 20.8,25.88 v32.7,25.88
N$5  (via drill 0.3)
  Top 0.254: v32.7,27.15 RJ_R5.1 | RJ_R5.1
  Bottom 0.254: RJ.LED1- 7.14,44.32 7.14,34.77 9.53,32.38 15.24,32.38 20.95,26.67 32.23,26.67 v32.7,27.15
N$6
  Top 0.254: VS.9 VS.10 41.12,63.66 41.59,64.14 42.39,64.14 44.29,62.23 44.29,61.44 45.72,60.01 45.72,59.91 VS_R2.2 | VS_R2.2
N$8
  Top 0.254: VS.18 44.84,66.9 45.4,67.47 46.93,67.47 VS_R1.2 48.16,67.53 50.48,69.85 VS_Q1.1
  Top 0.406: VS_Q1.1 | VS_C2.1 50.43,71.56 VS_Q1.1
N$9
  Top 0.254: ARM.48 36.46,35.03 34.29,32.86 32.54,32.86 31.75,32.07 31.75,31.81 ARM_Q1.2
  Top 0.406: ARM_C1.1 32.92,30.52 ARM_Q1.2
N$10
  Top 0.254: ARM.49 36.75,34.53 36.35,34.13 36.35,31.84 ARM_Q1.1
  Top 0.406: ARM_C2.1 35.03,30.52 ARM_Q1.1
N$11
  Top 0.254: VS.17 44.88,66.4 45.4,65.88 46.93,65.88 VS_R1.1 48.16,65.83 50.48,63.5 VS_Q1.2
  Top 0.406: VS_Q1.2 | VS_C1.1 50.43,61.79 VS_Q1.2
N$12
  Top 0.61: USB.VBUS 15.59,15.95 | 15.59,15.95 USB_C3.1 16.51,15.24 USB_Q1.3 | USB_C2.1 15.56,15.98 15.59,15.95
N$13
  Top 0.254: ARM.17 43.72,50.1 42.39,51.44 41.53,51.44 ARM_Q2.1
  Top 0.406: ARM_C4.1 40.68,51.54 ARM_Q2.1
N$14
  Top 0.254: 46,51.54 45.83,51.7 44.22,50.09 ARM.16
  Top 0.406: 46,51.54 ARM_C3.1 | 45.83,51.7 ARM_Q2.2
N$16
  Top 0.254: USB_Q1.1 15.66,11.28 USB_R1.2 USB_C1.2 | USB_C1.2 | USB_C1.2 15.66,5.71 USB_R2.1
N$18
  Top 0.406: 4.45,65.41 VS_GBUF.2 | 4.23,65.31 4.32,65.31 OUT.1 | 4.45,65.41 OUT.1 | 4.45,65.41 | 4.45,65.41 4.13,65.41 4.13,64.87 4.23,64.77
  Top 0.61: VS_GND.1 4.23,64.77 4.23,65.31
N$19
  Top 0.406: OUT.3 11.4,70.45 11.11,70.17 11.11,68.44 OUT.5 10.83,67.94 11.75,67.94 12.76,66.94 VS_R7.1
  Top 0.61: VS_R7.1 18.99,66.94 20,67.94 20.77,67.94 VS_CR.2
N$20
  Top 0.406: VS_R8.1 16.88,63.87 15.4,62.39 15.4,61.48 OUT.4 14.77,60.85 OUT.2
  Top 0.61: VS_R8.1 18.99,63.87 20.32,62.55 20.82,62.55 VS_CL.2
N$21
  Top 0.406: VS_CR.1 21.09,70.8
  Top 0.61: VS_CR2.1 20.61,70.59 VS_CR.1 | VS_RR.2 23.81,69.53 22.54,70.8 21.09,70.8
N$22
  Top 0.406: 20.82,60.01 VS_CL.1 21.09,60.01
  Top 0.61: VS_CL2.1 18.84,58.52 20.32,60.01 20.82,60.01 | VS_RL.2 23.81,61.28 22.54,60.01 21.09,60.01
N$23
  Top 1.016: D2.A 12.21,27.79 EXT_PWR.3
N$24
  Top 1.016: D2.C D3.C | D3.C | FUSE.1 18.6,22.19 D3.C
N$27
  Top 0.254: U3.4 | 28.73,73.03 U3.4 | U3.4 | 28.57,71.44 | C10.1 28.57,71.44 | 28.57,71.44 28.73,71.44
  Top 0.406: 28.73,71.44 28.73,73.03
N$28
  Top 0.406: C13.1 30,52.7 30,54.29 U4.4
N$29
  Top 0.406: RJ_C10.1
  Top 0.61: RJ_C10.1 RJ_R7.1
N$30
  Top 0.406: 4.29,58.9 5.87,58.9
N$31
  Top 0.254: 27.68,59.21 VS_R4.1
  Top 0.406: VS_C3.2 27.68,59.21
N$32
  Top 0.254: 27.68,67.47 VS_R5.1
  Top 0.406: VS_C4.2 27.68,67.47
N$33
  Top 0.254: 27.68,63.34 VS_R6.1
  Top 0.406: VS_C5.2 27.68,63.34
OUT
  pour Top (isolate 0.406): 36.51,4.92 36.51,10.95 38.1,12.54 39.37,12.54 42.39,9.53 47.94,9.53 49.21,8.26 49.21,4.29 47.94,3.02 38.26,3.02
POE+
  Top 0.254: D3.A 18.25,27.79 18.26,27.78
  Top 0.813: 18.26,27.78 18.41,27.94
  Top 1.016: 18.41,27.94 RJ.9
POE-  (via drill 0.5)
  Top 0.254: 21.59,27.79 POE_D1.A | 21.59,27.79
  Top 0.406: 26.35,26.57 POE_CLA.1 26.35,26.67 | 26.35,28.47 POE_ILM.1 | 21.59,27.79 22.21,27.79 22.38,27.62 | POE_C1.2 24.29,25.72
  Top 0.61: 26.35,26.57 POE.4
  Top 0.813: 26.35,27.62 26.35,26.67 | 26.35,27.62 26.35,28.47 | 24.29,27.62 22.38,27.62 | 24.29,27.62 26.35,27.62 | 24.29,25.72 24.29,27.62
  Top 1.016: 21.59,27.79 v21.59,31.59
  Bottom 0.813: RJ.10
  Bottom 1.016: v21.59,31.59 20.48,31.59 RJ.10
PWR+
  pour Top (isolate 0.406): 35.88,8.57 35.88,10.95 34.92,11.91 32.54,11.91 31.59,10.95 30.32,10.95 28.73,12.54 28.73,15.4 32.23,18.89 32.23,20.8 30.48,20.8 29.84,20.16 29.84,17.62 29.37,17.15 25.72,17.15 25.24,17.62 25.24,23.34 20.32,23.34 20.32,18.73 22.86,16.19 22.86,13.02 24.77,11.11 27.3,11.11 29.85,8.57 33.34,8.57 33.34,10.79 33.66,11.11 34.92,11.11 35.24,10.8 35.24,8.57
RCAP
  Top 0.254: 34.3,66.37 34.29,66.36 34.33,66.4 VS.44 | VS_C6.2 32.23,64.61 32.28,64.67
  Top 0.305: 34.3,66.37 32.6,64.67 32.28,64.67
RD+
  Top 0.254: ARM.40 36.69,39.03 36.51,39.21
  Top 0.406: 36.51,39.21 34.45,39.21 31.83,41.83 | RJ.1 26.04,47.62 29.84,43.81 | 29.84,43.81 31.83,41.83 | 29.84,43.81 RJ_R1.1 | RJ_C2.2 31.75,41.75 31.83,41.83
RD-
  Top 0.254: ARM.37 36.72,40.53 36.51,40.32
  Top 0.406: RJ.2 15.88,47.47 17.3,48.9 26.35,48.9 29.84,45.4 | 36.51,40.32 34.92,40.32 31.75,43.5 | 29.84,45.4 31.75,43.5 | 31.75,43.5 RJ_C5.2 | 29.84,45.4 RJ_R2.1 | 29.84,45.4
RESET
  Top 0.254: 46.22,29.03 46.2,29.05 ARM_R1.2 46.04,29.11 46.04,30.96 46.22,31.14 ARM.64
RIGHT
  Top 0.254: 27.84,69.53 VS_R5.2 28.16,69.22 | VS.39 33.81,68.9 33.5,69.22
  Top 0.406: 28.16,69.22 33.5,69.22
  Top 0.61: VS_RR.1 27.84,69.53
RXD
  Top 0.254: R2.2 77.69,62.45 74.93,59.69 74.93,49.53 76.2,48.26 UART2.5
SCK  (via drill 0.3)
  Top 0.254: v53.82,22.23 FM.6 | v61.91,16.03 63.36,16.03 SD.5 | v46.04,25.08 47.15,26.19 50.16,26.19 51.44,27.46 v51.44,29.05 | v51.44,29.05 | ARM.72 50.22,29.95 51.12,29.05 v51.44,29.05
  Bottom 0.254: v51.44,29.05 54.45,29.05 66.04,40.64 EXP.10 | v53.82,22.23 | v53.82,22.23 | v53.82,22.23 55.4,22.23 61.59,16.03 v61.91,16.03 | v53.82,22.23 48.9,22.23 v46.04,25.08
SD_1
  Top 0.254: SD_R5.2 73.08,24.61 73.5,24.61 75.56,22.54 75.56,20.32 66.93,11.69 SD.1
SD_3V3
  Top 0.254: 66.78,26.19 SD_R2.1
  Top 0.406: SD_R5.1 SD_R4.1 SD_R3.1 SD_R2.1 | 66.78,26.19 65.88,26.19 65.09,25.4 65.09,24.13 63.93,22.97 SD_Q1.3 62.23,21.59 60.48,19.84 59.37,19.84 58.58,19.05 58.58,17.3 59.69,16.19 59.91,16.19 SD_C1.1
  Top 0.61: SD.4 61.11,14.98 59.91,16.19
SD_8
  Top 0.254: SD.8 67.49,19.39 68.58,20.48 68.58,22.38 66.83,24.13 SD_R2.2 | SD_R2.2
SD_CS  (via drill 0.3)
  Top 0.254: SD_R4.2 70.96,23.97 71.28,23.65 71.28,17.71 66.36,12.79 SD.2 v61.91,12.79 | SD_R4.2 | ARM.67 47.72,33.88 v47.31,34.29 | v48.58,27.15 46.2,27.15 v45.09,26.04 | v45.09,26.04
  Bottom 0.254: v47.31,34.29 48.26,33.34 48.58,33.02 v48.58,27.15 | 61.67,12.79 v61.91,12.79 | 61.67,12.79 | 61.67,12.79 53.18,21.27 48.42,21.27 45.09,24.61 v45.09,26.04 | v45.09,26.04
SD_PWR  (via drill 0.3)
  Top 0.254: SD_Q1.1 63.18,27.05 SD_R1.2 63.02,27.2 63.02,27.94 62.39,28.57 v61.28,28.57 | ARM.66 47.22,30.55 v47.15,30.48
  Bottom 0.254: v47.15,30.48 46.83,30.16 46.83,26.51 47.78,25.56 55.4,25.56 58.42,28.57 v61.28,28.57
SHIELD
  Top 0.61: RJ.NC0 11.11,51.12 RJ_R7.2
  Bottom 0.813: RJ.NC1 RJ.NC0
SI  (via drill 0.3)
  Top 0.254: SD.3 60.73,13.88 56.83,17.78 56.83,20.95 | 51.72,32.1 ARM.75 51.72,31.78 51.75,31.75 v53.18,31.75 | 56.83,20.95 FM.5 | v53.18,31.75 | v53.18,31.75 | v53.18,31.75 53.98,30.96 53.98,28.26 56.83,25.4 56.83,20.95
  Bottom 0.254: v53.18,31.75 54.93,31.75 66.36,43.18 EXP.12
SO  (via drill 0.3)
  Top 0.254: v51.28,23.5 | v51.28,23.5 53.18,25.4 53.18,30 v52.55,30.64 | FM.2 v51.28,23.5 | v61.91,18.26 63.38,18.26 SD.7 68.29,18.29 69.85,19.84 69.85,22.86 68.9,23.81 SD_R3.2 | SD_R3.2 | ARM.74 51.22,31.01 51.59,30.64 v52.55,30.64 | v52.55,30.64
  Bottom 0.254: v52.55,30.64 54.93,30.64 66.2,41.91 71.12,41.91 EXP.11 | v51.28,23.5 56.36,23.5 61.59,18.26 v61.91,18.26
TCK
  Top 0.254: ARM.80 56.64,36.01 57.47,36.83 60.96,36.83 64.77,40.64 JTAG.9
TD+
  Top 0.254: ARM.43 36.74,37.53 36.51,37.31 | 27.94,37.31 27.94,37.94 | 27.94,37.94
  Top 0.406: RJ.5 19.53,42.55 24.77,37.31 26.04,37.31 | 26.04,37.31 27.94,37.31 | 27.94,37.31 36.51,37.31 | 26.04,37.62 RJ_C6.2 | 26.04,37.62 | 26.04,37.31 26.04,37.62 | RJ_R3.1 27.94,37.94 27.94,37.31
TD-
  Top 0.254: ARM.46 36.68,36.03 36.51,36.2
  Top 0.406: RJ.6 19.21,41.27 24.29,36.2 26.04,36.2 | 26.04,36.2 27.94,36.2 | 27.94,36.2 36.51,36.2 | 26.04,36.2 RJ_C9.2 | 26.04,36.2 | 27.94,36.2 RJ_R4.1 | 27.94,36.2
TDI
  Top 0.254: ARM.78 55.96,35.01 56.99,33.97 56.99,32.38 57.63,31.75 60.96,31.75 64.77,35.56 JTAG.5
TDO  (via drill 0.3)
  Top 0.254: ARM.77 55.03,34.51 v55.4,34.13 | v63.18,43.18 63.18,44.45 64.45,45.72 JTAG.13
  Bottom 0.254: v55.4,34.13 55.72,34.13 63.18,41.59 v63.18,43.18
TMS
  Top 0.254: ARM.79 56.57,35.51 57.78,34.29 60.96,34.29 64.77,38.1 JTAG.7
TRST
  Top 0.254: JTAG.3 67.31,33.02 68.1,33.81 68.1,41.12 67.31,41.91 63.82,41.91 61.28,39.37 56.36,39.37 ARM_R2.1 | ARM.89 54.74,40.51 55.24,40.01 56.36,40.01 | 56.52,39.85 56.46,39.85 ARM_R2.1 | ARM_R2.1
  Top 0.406: 56.36,40.01 56.52,39.85
TXD  (via drill 0.3)
  Top 0.254: v77.63,67.31 77.63,66.1 R1.2
  Bottom 0.254: v77.63,67.31 74.93,64.61 74.93,52.07 76.2,50.8 UART2.4
USB_PWR  (via drill 0.3)
  Top 0.254: v5.08,20.32 5.08,6.03 7.62,3.49 15.14,3.49 USB_R2.2 | ARM.61 44.72,28.05 43.34,26.67 43.34,24.61 42.7,23.97 33.18,23.97 v32.7,24.45
  Bottom 0.254: v5.08,20.32 3.97,21.43 3.97,29.37 5.71,31.11 14.61,31.11 | v32.7,24.45 32.07,25.08 20.64,25.08 14.61,31.11 | 14.61,31.11
VD
  Top 0.406: U1.2 35.56,14.29 34.13,12.86 32.07,12.86 31.69,12.48 C2.1
VS_CS  (via drill 0.3)
  Top 0.254: VS.23 45.22,69.4 v45.56,69.06 | ARM.34 39.57,42.03 v39.69,41.91
  Bottom 0.254: v39.69,41.91 38.1,43.5 38.1,51.44 45.56,58.9 v45.56,69.06
VS_DCS  (via drill 0.3)
  Top 0.254: v37.31,49.21 36.51,49.21 34.77,47.47 34.77,45.72 35.96,44.53 ARM.29 | VS.13 43.71,64.4 v44.45,63.66
  Bottom 0.254: v44.45,63.66 44.45,59.05 37.31,51.91 v37.31,49.21
VS_DREQ  (via drill 0.3)
  Top 0.254: ARM.27 36.86,45.53 36.51,45.88 v36.51,47.94 | VS.8 40.12,61.96 v40.8,61.28
  Bottom 0.254: v40.8,61.28 40.8,60.01 36.51,55.72 v36.51,47.94 | v40.8,61.28
VS_RST  (via drill 0.3)
  Top 0.254: VS.3 37.62,62.23 37.15,61.75 35.88,61.75 v33.34,59.21 | ARM.35 35.88,41.53 v35.88,41.59
  Bottom 0.254: v33.34,59.21 33.34,45.72 34.92,44.13 34.92,42.39 35.72,41.59 v35.88,41.59
VS_SCK  (via drill 0.3)
  Top 0.254: v35.72,46.99 35.72,45.72 36.41,45.03 ARM.28 | VS.28 40.62,70.19 v40.96,69.85
  Bottom 0.254: v40.96,69.85 40.96,65.09 38.1,62.23 36.67,62.23 35.72,61.28 v35.72,46.99
VS_SI  (via drill 0.3)
  Top 0.254: VS.29 40.12,69.49 v40.01,69.37 | ARM.31 36.7,43.53 v35.88,42.7
  Bottom 0.254: v40.01,69.37 40.01,65.25 37.62,62.87 36.35,62.87 34.92,61.44 34.92,46.35 36.83,44.45 36.83,43.5 36.04,42.7 v35.88,42.7
VS_SO  (via drill 0.3)
  Top 0.254: VS.30 39.62,70.42 v39.05,69.85 | ARM.30 36.09,44.03 v35.88,43.81
  Bottom 0.254: v35.88,43.81 35.88,44.29 34.13,46.04 34.13,61.59 36.04,63.5 37.15,63.5 39.05,65.41 v39.05,69.85

## Text on the board
Top: TOP
Bottom: BOT
tPlace: * | ARM-WebRadio v3 | www.watterott.net | * | > | SD | Watterott electronic
tNames: GND | RJ45 | 10-40V | microSD
bNames: GND
tValues: Line-Out config. | See schematics for